# Altium schematic sheet PG17_ LPC FWH _ I2C _ P.SchDoc
size 420 x 297 mm
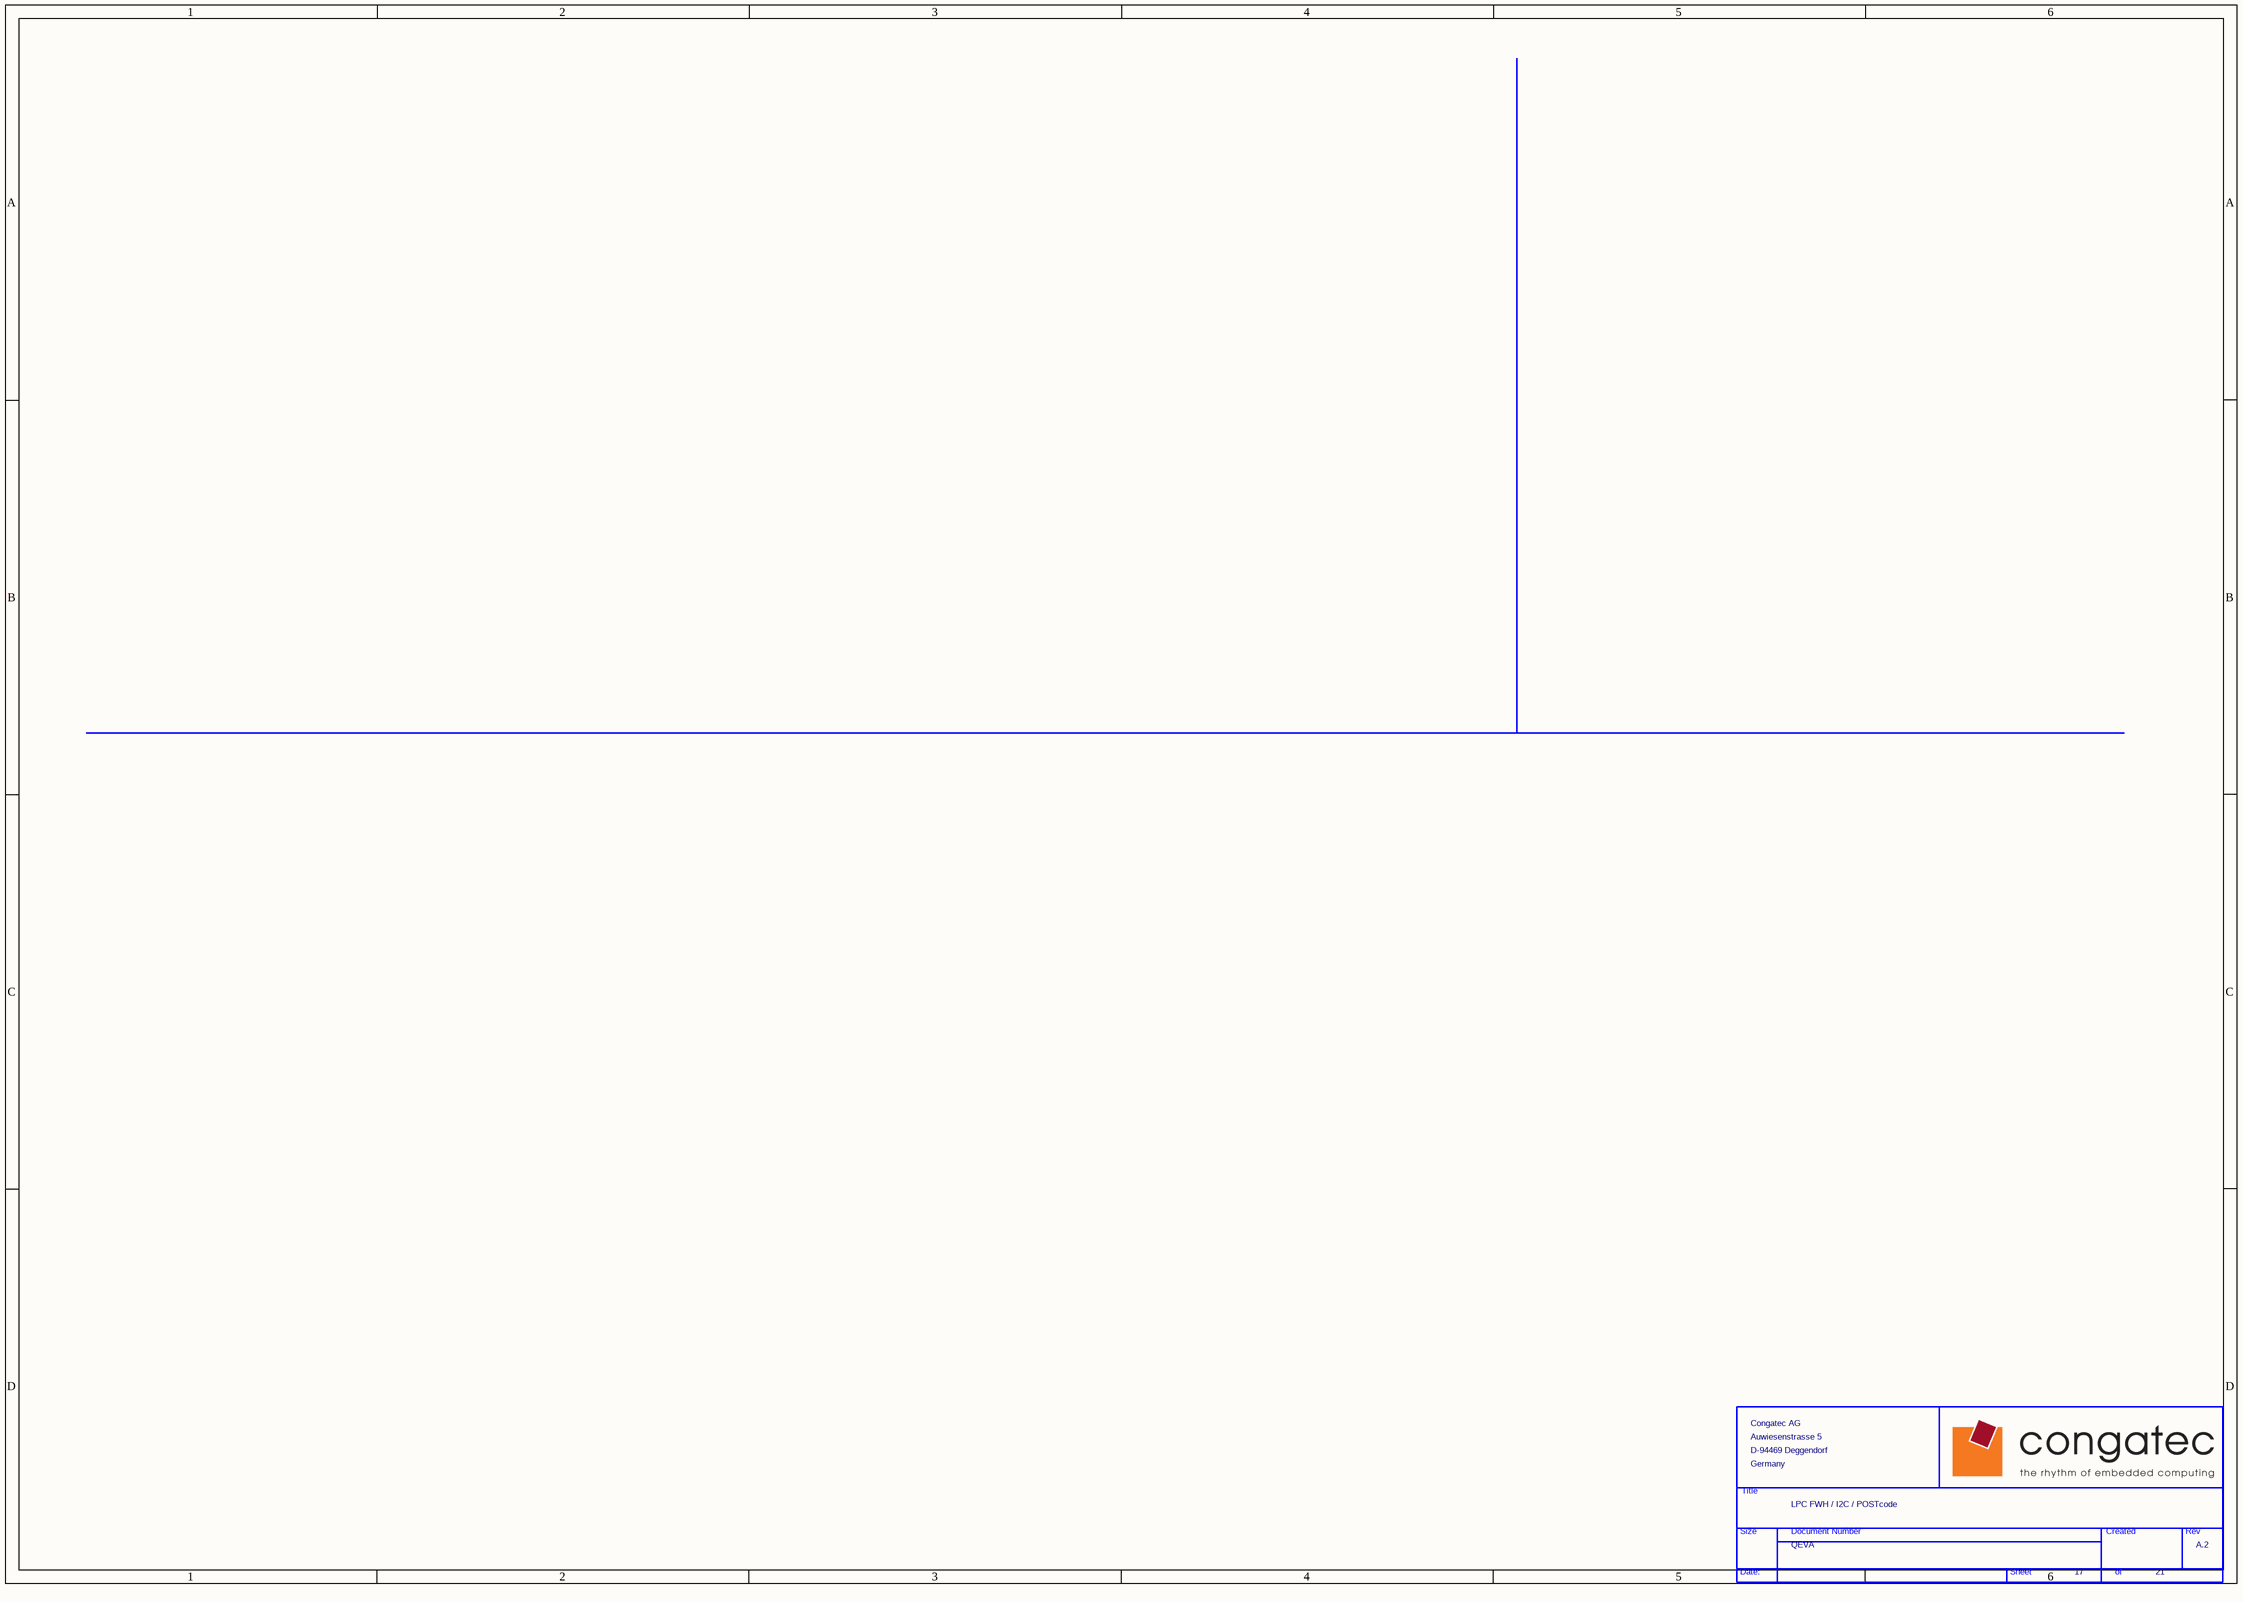
[diagram p0: PG17_ LPC FWH _ I2C _ P.SchDoc]

## Parts
*  Page Count: 21  Page Number: 17  Title: LPC FWH / I2C / POSTcode  RevCode: A.2  Doc: QEVA  OrgName: Congatec AG  OrgAddr1: Auwiesenstrasse 5  OrgAddr2: D-94469 Deggendorf  OrgAddr3: Germany  (hidden comment: TitleBlock_CONGA)  (graphical)

## Notes on the sheet
- (in symbol TitleBlock_CONGA) Title; Size; Document Number; Created; Rev; Date:; Sheet; of

## Library data of the parts
* = TitleBlock_CONGA: Page Create Date: March  8, 1995